# Altium project sonata-board.PrjPcb (part 1 of 2)
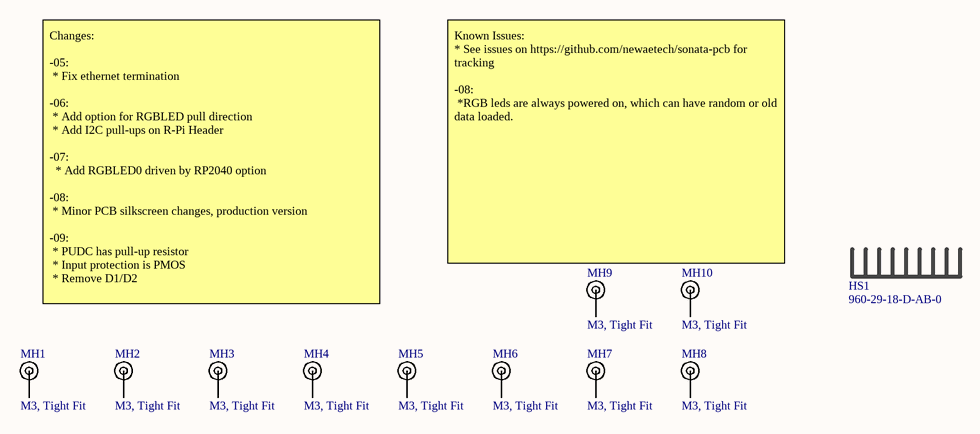
[diagram p0: sb-sonata-mech.SchDoc]
PrjRev: 03; PrjName: Sonata-XL; PrjLicense: CC-SA
7 sheets, 204 parts. Net scope: global (net labels, ports and power ports of the same name join across sheets).
Board files: cheriot-test.PcbDoc, sonata-xl-panel.PcbDoc
Sheets:
  sb-sonata-mech.SchDoc
  sb-sonata-headers1.SchDoc
  sb-sonata-usbrp.SchDoc
  sb-sonata-debug.SchDoc
  sb-sonata-fpgapwr2.SchDoc
  sb-sonata-analoginput.SchDoc
  sb-sonata-psu.SchDoc

## Sheet sb-sonata-mech.SchDoc: Mechanical & Title Page
size Letter; Organization: NewAE Technology Inc.; Address1: 1083 Queen St., Suite 196; Address2: Halifax; Address3: NS; Address4: Canada B3H 0B2; SheetNumber: 1; SheetTotal: 22; SheetApproved: YES

### Parts
HS1  960-29-18-D-AB-0  [960-29-18-D-AB-0]
MH1  M3, Tight Fit  [MOUNT_M3_TIGHT]
MH2  M3, Tight Fit  [MOUNT_M3_TIGHT]
MH3  M3, Tight Fit  [MOUNT_M3_TIGHT]
MH4  M3, Tight Fit  [MOUNT_M3_TIGHT]
MH5  M3, Tight Fit  [MOUNT_M3_TIGHT]
MH6  M3, Tight Fit  [MOUNT_M3_TIGHT]
MH7  M3, Tight Fit  [MOUNT_M3_TIGHT]
MH8  M3, Tight Fit  [MOUNT_M3_TIGHT]
MH9  M3, Tight Fit  [MOUNT_M3_TIGHT]
MH10  M3, Tight Fit  [MOUNT_M3_TIGHT]

### Nets

Not connected (* = marked no-connect by the designer): HS1 MH; MH1 1; MH2 1; MH3 1; MH4 1; MH5 1; MH6 1; MH7 1; MH8 1; MH9 1; MH10 1

### Notes on the sheet
- Changes:
  -05:
  * Fix ethernet termination
  -06:
  * Add option for RGBLED pull direction
  * Add I2C pull-ups on R-Pi Header
  -07:
  * Add RGBLED0 driven by RP2040 option
  -08:
  * Minor PCB silkscreen changes, production version
  -09:
  * PUDC has pull-up resistor
  * Input protection is PMOS
  * Remove D1/D2
- Known Issues:
  * See issues on https://github.com/newaetech/sonata-pcb for tracking
  -08:
  *RGB leds are always powered on, which can have random or old data loaded.
- Title:
- Date:
- Rev:
- Time:
- Project:
- Sheet
- of
- License:
- Copyright © NewAE Technology Inc.
- Approved:
- NewAE.com
- File:

### Library data of the parts
HS1 = 960-29-18-D-AB-0: Heatsink, 29mm square; Manufacture 1: Wakefield-Vette; Component Group: Mechanical; PP Material Stack: 0; Part Number: 960-29-18-D-AB-0; Manufacture Part Number 1: 960-29-18-D-AB-0; Supplier 1: Digi-Key; Supplier Part Number 1: 345-1834-ND; Component Kind: Standard; Component Type: Standard; PP Rotation: 0; PP Rotation1: 0
MH1-MH10 = MOUNT_M3_TIGHT: Machine screw M3 Mounting Hole; Component Group: Mechanical; PP Material Stack: 0; Part Number: MOUNT_M3_TIGHT; Pin Count: 1; Component Kind: Mechanical; Component Type: Mechanical; PP Rotation: 0

## Sheet sb-sonata-headers1.SchDoc: Header Pins
size Letter; Organization: NewAE Technology Inc.; Address1: 1083 Queen St., Suite 196; Address2: Halifax; Address3: NS; Address4: Canada B3H 0B2; SheetNumber: 4; SheetTotal: 20; SheetApproved: YES
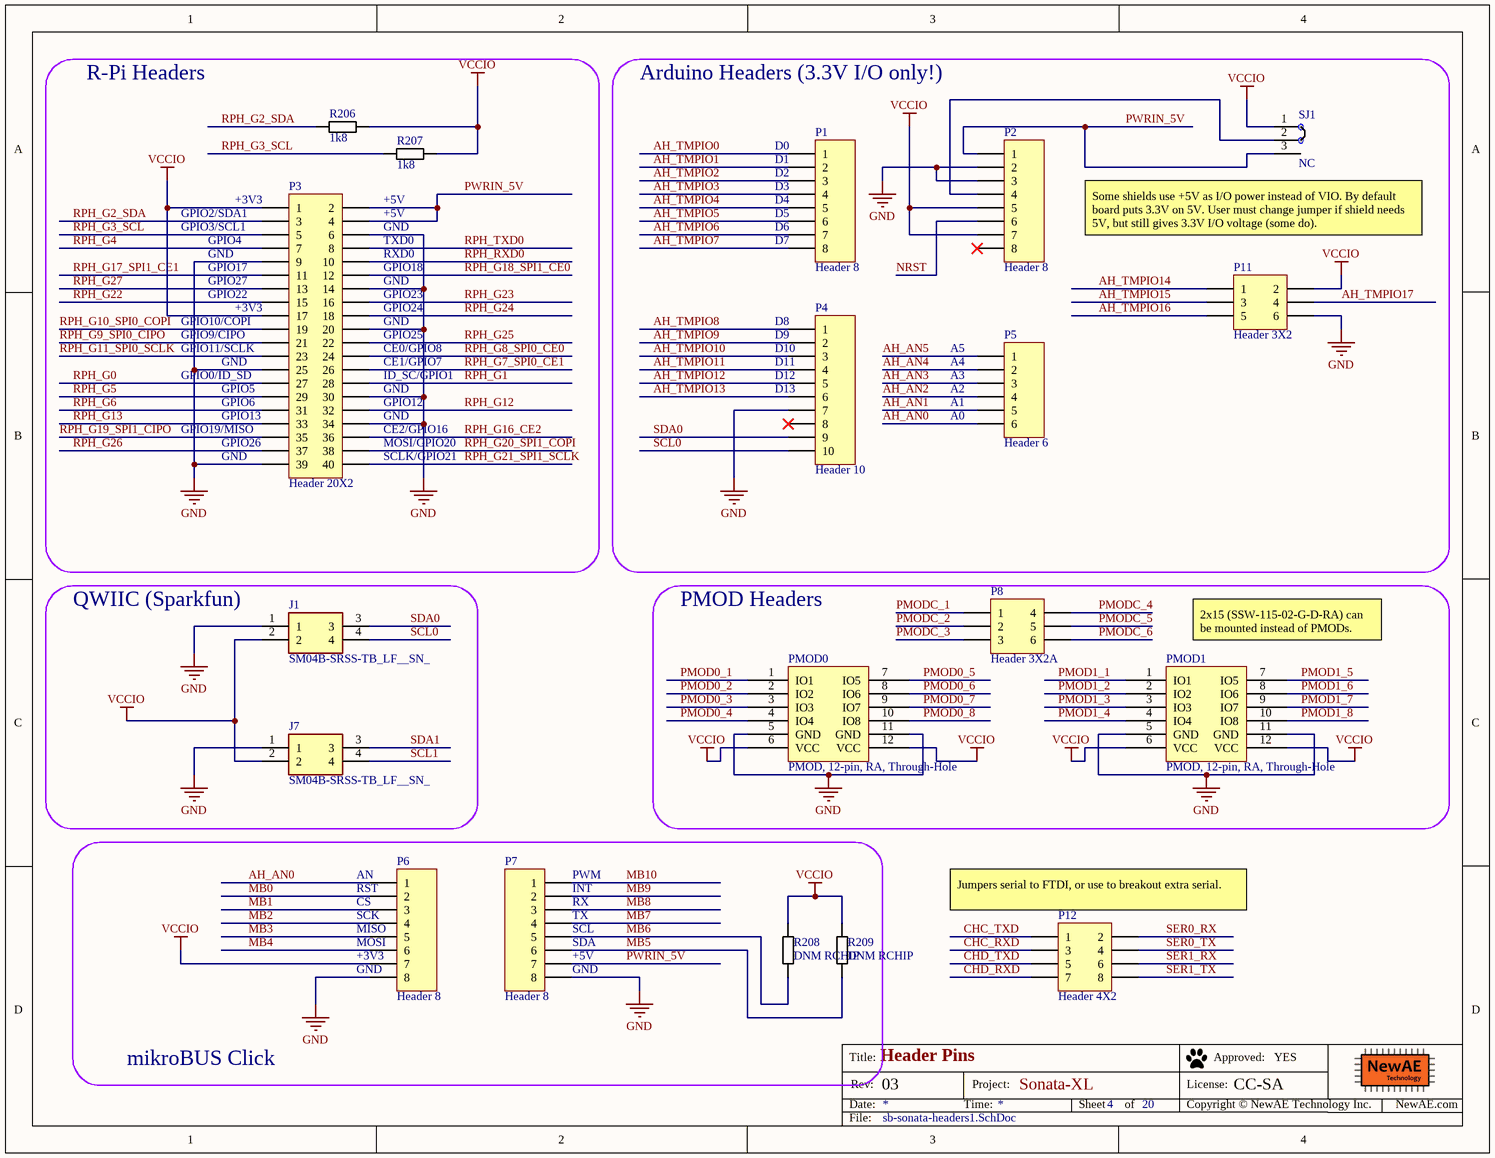
[diagram p1: sb-sonata-headers1.SchDoc]

### Parts
J1  SM04B-SRSS-TB_LF__SN_  [SM04B-SRSS-TB(LFSN)]
J7  SM04B-SRSS-TB_LF__SN_  [SM04B-SRSS-TB(LFSN)]
P1  Header 8  [HDR1X8_SLW-108-01-T-S]
P2  Header 8  [HDR1X8_SLW-108-01-T-S]
P3  Header 20X2  [HDR2X20_861400402YO2LF]
P4  Header 10  [HDR1X10_SLW-110-01-T-S]
P5  Header 6  [HDR1X6_SLW-106-01-T-S]
P6  Header 8  [HDR1X8_SLW-108-01-T-S]
P7  Header 8  [HDR1X8_SLW-108-01-T-S]
P8  Header 3X2A  [HDR2X3_CEN]
P11  Header 3X2  [HDR2X3_XG8T-0641]
P12  Header 4X2  [HDR2X4_XG8T-0841]
PMOD0  PMOD, 12-pin, RA, Through-Hole  [SAMTEC_SSW_106_02_X_D_RA_PMOD]
PMOD1  PMOD, 12-pin, RA, Through-Hole  [SAMTEC_SSW_106_02_X_D_RA_PMOD]
R206  1k8  [RESC1608X55N]
R207  1k8  [RESC1608X55N]
R208  DNM RCHIP  [RESC1608X55N]
R209  DNM RCHIP  [RESC1608X55N]
SJ1  NC  [SJ_3S_NC12]  (no BOM)

### Blocks framed on the sheet
R-Pi Headers: P3 R206 R207
Arduino Headers (3.3V I/O only!): P1 P2 P4 P5 P11 SJ1
QWIIC (Sparkfun): J1 J7
PMOD Headers: P8 PMOD0 PMOD1
mikroBUS Click: P6 P7 R208 R209

### Nets
GND: J1.1 J7.1 P2.2 P2.3 P3.6 P3.9 P3.14 P3.20 P3.25 P3.30 P3.34 P3.39 P4.7 P6.8 P7.8 P11.6 PMOD0.5(GND) PMOD0.11(GND) PMOD1.5(GND) PMOD1.11(GND)
VCCIO: J1.2 J7.2 P2.5 P2.7 P3.1 P3.17 P6.7 P11.2 PMOD0.6(VCC) PMOD0.12(VCC) PMOD1.6(VCC) PMOD1.12(VCC) R206.2 R207.2 R208.1 R209.1 SJ1.1  [project net 3V3_FTDI]
AH_AN0: P5.6 P6.1
AH_AN1: P5.5
AH_AN2: P5.4
AH_AN3: P5.3
AH_AN4: P5.2
AH_AN5: P5.1
AH_TMPIO0: P1.1
AH_TMPIO1: P1.2
AH_TMPIO2: P1.3
AH_TMPIO3: P1.4
AH_TMPIO4: P1.5
AH_TMPIO5: P1.6
AH_TMPIO6: P1.7
AH_TMPIO7: P1.8
AH_TMPIO8: P4.1
AH_TMPIO9: P4.2
AH_TMPIO10: P4.3
AH_TMPIO11: P4.4
AH_TMPIO12: P4.5
AH_TMPIO13: P4.6
AH_TMPIO14: P11.1
AH_TMPIO15: P11.3
AH_TMPIO16: P11.5
AH_TMPIO17: P11.4
CHC_RXD: P12.3
CHC_TXD: P12.1
CHD_RXD: P12.7
CHD_TXD: P12.5
MB0: P6.2
MB1: P6.3
MB2: P6.4
MB3: P6.5
MB4: P6.6
MB5: P7.6 R209.2
MB6: P7.5 R208.2
MB7: P7.4
MB8: P7.3
MB9: P7.2
MB10: P7.1
NRST: P2.6
PMOD0_1: PMOD0.1(IO1)
PMOD0_2: PMOD0.2(IO2)
PMOD0_3: PMOD0.3(IO3)
PMOD0_4: PMOD0.4(IO4)
PMOD0_5: PMOD0.7(IO5)
PMOD0_6: PMOD0.8(IO6)
PMOD0_7: PMOD0.9(IO7)
PMOD0_8: PMOD0.10(IO8)
PMOD1_1: PMOD1.1(IO1)
PMOD1_2: PMOD1.2(IO2)
PMOD1_3: PMOD1.3(IO3)
PMOD1_4: PMOD1.4(IO4)
PMOD1_5: PMOD1.7(IO5)
PMOD1_6: PMOD1.8(IO6)
PMOD1_7: PMOD1.9(IO7)
PMOD1_8: PMOD1.10(IO8)
PMODC_1: P8.1
PMODC_2: P8.2
PMODC_3: P8.3
PMODC_4: P8.4
PMODC_5: P8.5
PMODC_6: P8.6
PWRIN_5V: P2.1 P3.2 P3.4 P7.7 SJ1.3
RPH_G0: P3.27
RPH_G1: P3.28
RPH_G2_SDA: P3.3 R206.1
RPH_G3_SCL: P3.5 R207.1
RPH_G4: P3.7
RPH_G5: P3.29
RPH_G6: P3.31
RPH_G7_SPI0_CE1: P3.26
RPH_G8_SPI0_CE0: P3.24
RPH_G9_SPI0_CIPO: P3.21
RPH_G10_SPI0_COPI: P3.19
RPH_G11_SPI0_SCLK: P3.23
RPH_G12: P3.32
RPH_G13: P3.33
RPH_G16_CE2: P3.36
RPH_G17_SPI1_CE1: P3.11
RPH_G18_SPI1_CE0: P3.12
RPH_G19_SPI1_CIPO: P3.35
RPH_G20_SPI1_COPI: P3.38
RPH_G21_SPI1_SCLK: P3.40
RPH_G22: P3.15
RPH_G23: P3.16
RPH_G24: P3.18
RPH_G25: P3.22
RPH_G26: P3.37
RPH_G27: P3.13
RPH_RXD0: P3.10
RPH_TXD0: P3.8
SCL0: J1.4 P4.10
SCL1: J7.4
SDA0: J1.3 P4.9
SDA1: J7.3
SER0_RX: P12.2
SER0_TX: P12.4
SER1_RX: P12.6
SER1_TX: P12.8
NetP2_4: P2.4 SJ1.2

Not connected (* = marked no-connect by the designer): P2 8*; P4 8*

### Notes on the sheet
- (near P1) D0
- (near P1) D1
- (near P3) GPIO2/SDA1
- (near P3) GPIO3/SCL1
- (near P3) +3V3
- +5V
- (near P3) GND
- (near P1) D2
- (near P1) D3
- (near P1) D4
- (near P1) D5
- (near P1) D6
- (near SJ1) Some shields use +5V as I/O power instead of VIO. By default board puts 3.3V on 5V. User must change jumper if shield needs 5V, but still gives 3.3V I/O voltage (some do).
- (near P3) GPIO4
- GND
- (near P3) GPIO17
- (near P3) GPIO27
- (near P3) GPIO22
- (near P3) TXD0
- (near P3) RXD0
- (near P3) GPIO18
- (near P3) GPIO23
- (near P1) D7
- (near P3) GPIO10/COPI
- (near P3) GPIO9/CIPO
- (near P3) GPIO11/SCLK
- (near P3) GPIO24
- (near P3) GPIO25
- (near P3) CE0/GPIO8
- (near P3) CE1/GPIO7
- (near P4) D8
- (near P4) D9
- (near P4) D10
- (near P4) D11
- (near P5) A4
- (near P5) A5
- (near P3) GPIO0/ID_SD
- (near P3) GPIO19/MISO
- (near P3) GPIO5
- (near P3) GPIO6
- (near P3) GPIO13
- (near P3) ID_SC/GPIO1
- (near P3) GPIO12
- (near P3) CE2/GPIO16
- (near P4) D12
- (near P4) D13
- (near P5) A0
- (near P5) A1
- (near P5) A2
- (near P5) A3
- (near P3) GPIO26
- (near P3) MOSI/GPIO20
- (near P3) SCLK/GPIO21
- (near PMOD1) 2x15 (SSW-115-02-G-D-RA) can be mounted instead of PMODs.
- (near P6) AN
- (near P6) RST
- (near P6) CS
- (near P7) RX
- (near P7) INT
- (near P7) PWM
- (near P12) Jumpers serial to FTDI, or use to breakout extra serial.
- (near P6) SCK
- (near P6) MISO
- (near P6) MOSI
- (near P6) +3V3
- (near P6) GND
- (near P7) GND
- (near P7) +5V
- (near P7) SDA
- (near P7) SCL
- (near P7) TX
- Title:
- Date:
- Rev:
- Time:
- Project:
- Sheet
- of
- License:
- Copyright © NewAE Technology Inc.
- Approved:
- NewAE.com
- File:

### Library data of the parts
J1 J7 = SM04B-SRSS-TB_LF__SN_: Connector; Manufacturer_Name: JST (JAPAN SOLDERLESS TERMINALS); Manufacturer_Part_Number: SM04B-SRSS-TB(LF)(SN); Datasheet Link: http://www.jst-mfg.com/product/pdf/eng/eSH.pdf; Arrow Part Number: SM04B-SRSS-TB(LF)(SN); Arrow Price/Stock: https://www.arrow.com/en/products/sm04b-srss-tb-lf-sn/jst-manufacturing?region=europe
P1 P2 P6 P7 = Header 8: Header, 8-Pin; LatestRevisionDate: 17-Jul-2002; LatestRevisionNote: Re-released for DXP Platform.; Publisher: Altium Limited
P3 = Header 20X2: Header, 20-Pin, Dual row; LatestRevisionDate: 17-Jul-2002; LatestRevisionNote: Re-released for DXP Platform.; Publisher: Altium Limited
P4 = Header 10: Header, 10-Pin; LatestRevisionDate: 17-Jul-2002; LatestRevisionNote: Re-released for DXP Platform.; Publisher: Altium Limited
P5 = Header 6: Header, 6-Pin; LatestRevisionDate: 17-Jul-2002; LatestRevisionNote: Re-released for DXP Platform.; Publisher: Altium Limited
P8 = Header 3X2A: Header, 3-Pin, Dual row; LatestRevisionDate: 17-Jul-2002; LatestRevisionNote: Re-released for DXP Platform.; Publisher: Altium Limited
P11 = Header 3X2: Header, 3-Pin, Dual row; LatestRevisionDate: 17-Jul-2002; LatestRevisionNote: Re-released for DXP Platform.; Publisher: Altium Limited
P12 = Header 4X2: Header, 4-Pin, Dual row; LatestRevisionDate: 17-Jul-2002; LatestRevisionNote: Re-released for DXP Platform.; Publisher: Altium Limited
PMOD0 PMOD1 = PMOD_2ROW_FEMALERATH: Component Group: Connector; PP Material Stack: 0; Part Number: PMOD_2ROW_FEMALERATH; Pin Count: 12; Supplier 1: Digi-Key; Supplier Part Number 1: SAM1215-06-ND; Component Kind: Standard; Component Type: Standard; PP Rotation: 0; PP Rotation1: 0
R206 R207 = RCHIP-1K8-0603: 1k8 res, 0603, 1%, 1/10W; Manufacture 1: Yageo; Manufacture Part Number 1: RC0603FR-071K8L; Component Group: Resistor; Case-EIA: 0603; Case-Metric: 1608; Rated Power: 0.1W; Rated Voltage: 75VDC; Part Number: RCHIP-1K8-0603; Footprint: 0603; Pin Count: 2; Supplier 1: Digi-Key; Supplier Part Number 1: 311-1.80KHRCT-ND; Value: 1k8; Tolerance: 1%; Mounting Technology: SMT; Temperature Range: -55C to 155C; Component Kind: Standard; Component Type: Standard
R208 R209 = RCHIP-DNM-0603: Do Not Mount Resistor; Case-EIA: 0603; Case-Metric: 1608; Part Number: RCHIP-DNM-0603; Component Group: Resistor; Footprint: 0603; Pin Count: 2; Mounting Technology: SMT; Component Kind: Standard; Component Type: Standard
SJ1 = SJ_3S_12JMP: Solder Jumper, NC; Component Group: PCB Feature; Part Number: SJ_3S_12JMP; Pin Count: 3; Mounting Technology: COPPER; Component Type: Standard (No BOM)

## Sheet sb-sonata-usbrp.SchDoc: RP2040 Controller
size Letter; Organization: NewAE Technology Inc.; Address1: 1083 Queen St., Suite 196; Address2: Halifax; Address3: NS; Address4: Canada B3H 0B2; SheetNumber: 5; SheetTotal: 22; SheetApproved: YES
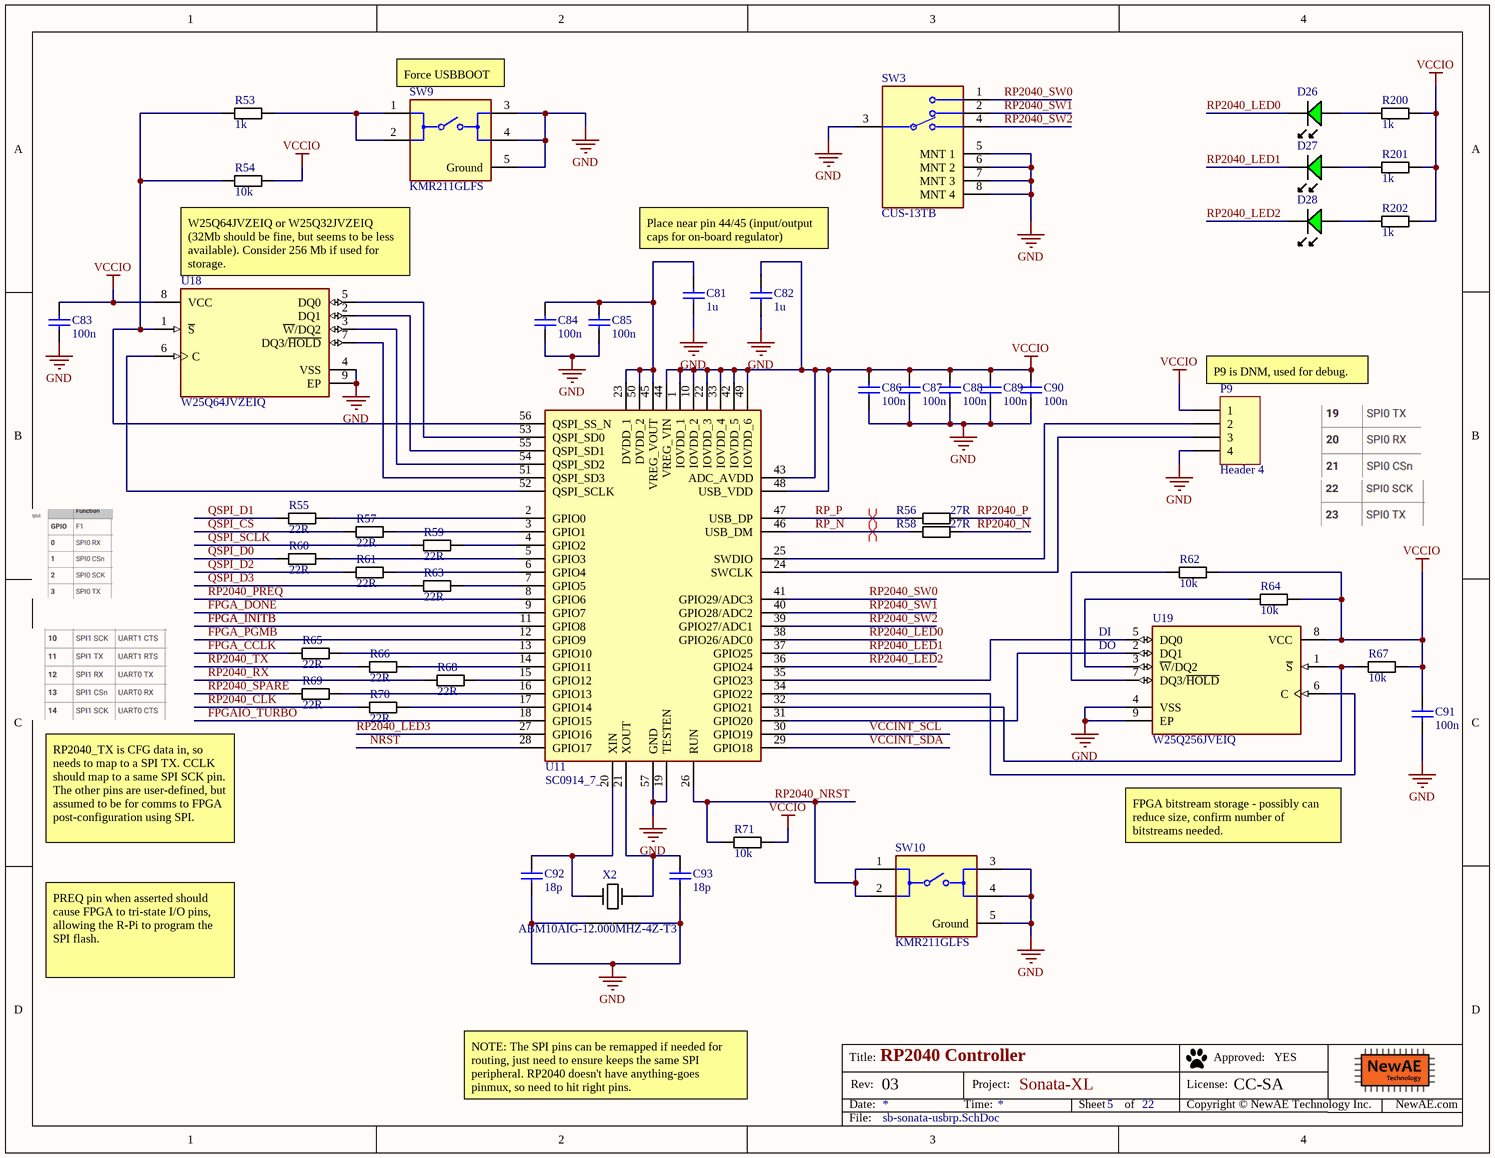
[diagram p2: sb-sonata-usbrp.SchDoc]

### Parts
C81  1u  [CAPC0603_M]
C82  1u  [CAPC0603_M]
C83  100n  [CAPC0402_M]
C84  100n  [CAPC0402_M]
C85  100n  [CAPC0402_M]
C86  100n  [CAPC0402_M]
C87  100n  [CAPC0402_M]
C88  100n  [CAPC0402_M]
C89  100n  [CAPC0402_M]
C90  100n  [CAPC0402_M]
C91  100n  [CAPC0402_M]
C92  18p  [CAPC0402_M]
C93  18p  [CAPC0402_M]
D26  LED, 0603, Green  [LED-0603-GREEN]  (value not drawn)
D27  LED, 0603, Green  [LED-0603-GREEN]  (value not drawn)
D28  LED, 0603, Green  [LED-0603-GREEN]  (value not drawn)
P9  Header 4  [HDR1X4]
R53  1k  [RESC1005X40N]
R54  10k  [RESC1005X40N]
R55  22R  [RESC1005X40N]
R56  27R  [RESC1005X40N]
R57  22R  [RESC1005X40N]
R58  27R  [RESC1005X40N]
R59  22R  [RESC1005X40N]
R60  22R  [RESC1005X40N]
R61  22R  [RESC1005X40N]
R62  10k  [RESC1005X40N]
R63  22R  [RESC1005X40N]
R64  10k  [RESC1005X40N]
R65  22R  [RESC1005X40N]
R66  22R  [RESC1005X40N]
R67  10k  [RESC1005X40N]
R68  22R  [RESC1005X40N]
R69  22R  [RESC1005X40N]
R70  22R  [RESC1005X40N]
R71  10k  [RESC1005X40N]
R200  1k  [RESC1005X40N]
R201  1k  [RESC1005X40N]
R202  1k  [RESC1005X40N]
SW3  CUS-13TB  [FP-CUS-13TB-MFG]
SW9  KMR211GLFS  [FP-KMR211GLFS-MFG]
SW10  KMR211GLFS  [FP-KMR211GLFS-MFG]
U11  SC0914_7_  [QFN40P700X700X90-57N-D]
U18  W25Q64JVZEIQ  [WSON68_Micron]
U19  W25Q256JVEIQ  [WSON68_Micron]
X2  ABM10AIG-12.000MHZ-4Z-T3  [2.5x2mm XTAL]

### Nets
GND: C81.2 C82.2 C83.2 C84.2 C85.2 C86.2 C87.2 C88.2 C89.2 C90.2 C91.2 C92.2 C93.2 P9.4 SW3.3(C) SW3.5(MNT_1) SW3.6(MNT_2) SW3.7(MNT_3) SW3.8(MNT_4) SW9.3 SW9.4 SW9.5(Ground) SW10.3 SW10.4 SW10.5(Ground) U11.19(TESTEN) U11.57(GND) U18.4(VSS) U18.9(EP) U19.4(VSS) U19.9(EP) X2.2(GND) X2.4(GND)
VCCIO: C82.1 C83.1 C86.1 C87.1 C88.1 C89.1 C90.1 C91.1 P9.1 R54.1 R62.1 R64.1 R67.2 R71.2 R200.2 R201.2 R202.2 U11.1(IOVDD_1) U11.10(IOVDD_2) U11.22(IOVDD_3) U11.33(IOVDD_4) U11.42(IOVDD_5) U11.43(ADC_AVDD) U11.44(VREG_VIN) U11.48(USB_VDD) U11.49(IOVDD_6) U18.8(VCC) U19.8(VCC)  [project net 3V3_FTDI]
FPGA_CCLK: R65.1
FPGA_DONE: U11.9(GPIO7)
FPGA_INITB: U11.11(GPIO8)
FPGA_PGMB: U11.12(GPIO9)
FPGAIO_TURBO: U11.18(GPIO15)
NRST: U11.28(GPIO17)
QSPI_CS: R57.1
QSPI_D0: R60.1
QSPI_D1: R55.1
QSPI_D2: R61.1
QSPI_D3: R63.1
QSPI_SCLK: R59.1
RP2040_CLK: R70.1
RP2040_LED0: D26.K U11.38(GPIO26/ADC0)
RP2040_LED1: D27.K U11.37(GPIO25)
RP2040_LED2: D28.K U11.36(GPIO24)
RP2040_LED3: U11.27(GPIO16)
RP2040_N: R58.1
RP2040_NRST: R71.1 SW10.1 SW10.2 U11.26(RUN)
RP2040_P: R56.1
RP2040_PREQ: U11.8(GPIO6)
RP2040_RX: R68.1
RP2040_SPARE: R69.1
RP2040_SW0: SW3.1 U11.41(GPIO29/ADC3)
RP2040_SW1: SW3.2 U11.40(GPIO28/ADC2)
RP2040_SW2: SW3.4 U11.39(GPIO27/ADC1)
RP2040_TX: R66.1
RP_N: R58.2 U11.46(USB_DM)
RP_P: R56.2 U11.47(USB_DP)
VCCINT_SCL: U11.30(GPIO19)
VCCINT_SDA: U11.29(GPIO18)
NetC81_1: C81.1 C84.1 C85.1 U11.23(DVDD_1) U11.45(VREG_VOUT) U11.50(DVDD_2)
NetC92_1: C92.1 U11.20(XIN) X2.1(IN)
NetC93_1: C93.1 U11.21(XOUT) X2.3(OUT)
NetD26_A: D26.A R200.1
NetD27_A: D27.A R201.1
NetD28_A: D28.A R202.1
NetP9_2: P9.2 U11.25(SWDIO)
NetP9_3: P9.3 U11.24(SWCLK)
NetR53_1: R53.1 R54.2 U11.56(QSPI_SS_N) U18.1(~{S})
NetR53_2: R53.2 SW9.1 SW9.2
NetR55_2: R55.2 U11.2(GPIO0)
NetR57_2: R57.2 U11.3(GPIO1)
NetR59_2: R59.2 U11.4(GPIO2)
NetR60_2: R60.2 U11.5(GPIO3)
NetR61_2: R61.2 U11.6(GPIO4)
NetR62_2: R62.2 U19.7(DQ3/~{HOLD})
NetR63_2: R63.2 U11.7(GPIO5)
NetR64_2: R64.2 U19.3(~{W}/DQ2)
NetR65_2: R65.2 U11.13(GPIO10)
NetR66_2: R66.2 U11.14(GPIO11)
NetR67_1: R67.1 U11.32(GPIO21) U19.1(~{S})
NetR68_2: R68.2 U11.15(GPIO12)
NetR69_2: R69.2 U11.16(GPIO13)
NetR70_2: R70.2 U11.17(GPIO14)
NetU11_31: U11.31(GPIO20) U19.2(DQ1)
NetU11_34: U11.34(GPIO22) U19.6(C)
NetU11_35: U11.35(GPIO23) U19.5(DQ0)
NetU11_51: U11.51(QSPI_SD3) U18.7(DQ3/~{HOLD})
NetU11_52: U11.52(QSPI_SCLK) U18.6(C)
NetU11_53: U11.53(QSPI_SD0) U18.5(DQ0)
NetU11_54: U11.54(QSPI_SD2) U18.3(~{W}/DQ2)
NetU11_55: U11.55(QSPI_SD1) U18.2(DQ1)

### Layout directives
differential pair; differential pair class USB_DIFF_PAIR: RP_N, RP_P

### Notes on the sheet
- (near SW9) Force USBBOOT
- W25Q64JVZEIQ or W25Q32JVZEIQ (32Mb should be fine, but seems to be less available). Consider 256 Mb if used for storage.
- Place near pin 44/45 (input/output caps for on-board regulator)
- (near P9) P9 is DNM, used for debug.
- (near U19) DI
- (near U19) DO
- RP2040_TX is CFG data in, so needs to map to a SPI TX. CCLK should map to a same SPI SCK pin. The other pins are user-defined, but assumed to be for comms to FPGA post-configuration using SPI.
- FPGA bitstream storage - possibly can reduce size, confirm number of bitstreams needed.
- PREQ pin when asserted should cause FPGA to tri-state I/O pins, allowing the R-Pi to program the SPI flash.
- NOTE: The SPI pins can be remapped if needed for routing, just need to ensure keeps the same SPI peripheral. RP2040 doesn't have anything-goes pinmux, so need to hit right pins.
- Title:
- Date:
- Rev:
- Time:
- Project:
- Sheet
- of
- License:
- Copyright © NewAE Technology Inc.
- Approved:
- NewAE.com
- File:

### Library data of the parts
C81 C82 = CCHIP-1u-0603: 1u, 0603, 50V; Manufacture Part Number 1: CL10A105KB8NNNC; Component Group: Capacitor; Case-EIA: 0603; Case-Metric: 1608; Rated Voltage: 50VDC; Part Number: CCHIP-1u-0603; Footprint: 0603; Pin Count: 2; Supplier 1: Digi-Key; Supplier Part Number 1: 1276-1860-1-ND; Value: 1u; Mounting Technology: SMT; Component Kind: Standard; Component Type: Standard
C83-C91 = CCHIP-100n-0402: 100n, 0402; Manufacture Part Number 1: CGA2B3X7R1V104K050BB; Component Group: Capacitor; Case-EIA: 0402; Part Number: CCHIP-100n-0402; Footprint: 0402; Pin Count: 2; Supplier 1: Digi-Key; Supplier Part Number 1: 445-6901-1-ND; Value: 100n; Mounting Technology: SMT; Component Kind: Standard; Component Type: Standard
C92 C93 = CCHIP-18p-0402: 18p, 0402; Manufacture Part Number 1: GRM1555C1H180JA01D; Component Group: Capacitor; Case-EIA: 0402; Part Number: CCHIP-18p-0402; Footprint: 0402; Pin Count: 2; Supplier 1: Digi-Key; Supplier Part Number 1: 490-5858-1-ND; Value: 18p; Mounting Technology: SMT; Component Kind: Standard; Component Type: Standard
D26-D28 = LEDCHIP_0603_GREEN: Chip LED, Green; Manufacture 1: Kingbright; Manufacture Part Number 1: APT1608CGCK; Component Group: Optical; PP Material Stack: 16; PP Rotation: -90; Part Number: LEDCHIP_0603_GREEN; Pin Count: 2; Supplier 1: Digi-Key; Supplier Part Number 1: 754-1116-1-ND; Mounting Technology: SMT; Component Kind: Standard; Component Type: Standard
P9 = Header 4: Header, 4-Pin; LatestRevisionDate: 17-Jul-2002; LatestRevisionNote: Re-released for DXP Platform.; Publisher: Altium Limited
R53 R200-R202 = RCHIP-1K-0402: 1k res, 0402, 1%, 1/16W; Manufacture 1: Yageo; Manufacture Part Number 1: RC0402FR-071KL; Component Group: Resistor; Case-EIA: 0402; Case-Metric: 1005; Rated Power: 0.063W; Rated Voltage: 75VDC; Part Number: RCHIP-1K-0402; Footprint: 0402; Pin Count: 2; Supplier 1: Digi-Key; Supplier Part Number 1: 311-1.00KLRCT-ND; Value: 1k; Tolerance: 1%; Mounting Technology: SMT; Temperature Range: -55C to 155C; Component Kind: Standard; Component Type: Standard
R54 R62 R64 R67 R71 = RCHIP-10K-0402: 10k res, 0402, 1%, 1/16W; Manufacture 1: Yageo; Manufacture Part Number 1: RC0402FR-0710KL; Component Group: Resistor; Case-EIA: 0402; Case-Metric: 1005; Rated Power: 0.063W; Rated Voltage: 75VDC; Part Number: RCHIP-10K-0402; Footprint: 0402; Pin Count: 2; Supplier 1: Digi-Key; Supplier Part Number 1: 311-10.0KLRCT-ND; Value: 10k; Tolerance: 1%; Mounting Technology: SMT; Temperature Range: -55C to 155C; Component Kind: Standard; Component Type: Standard
R55 R57 R59-R61 R63 R65 R66 R68-R70 = RCHIP-22R-0402: 22R res, 0402, 1%, 1/16W; Manufacture 1: Yageo; Manufacture Part Number 1: RC0402FR-0722RL; Component Group: Resistor; Case-EIA: 0402; Case-Metric: 1005; Rated Power: 0.063W; Rated Voltage: 75VDC; Part Number: RCHIP-22R-0402; Footprint: 0402; Pin Count: 2; Supplier 1: Digi-Key; Supplier Part Number 1: 311-22.0LRCT-ND; Value: 22R; Tolerance: 1%; Mounting Technology: SMT; Temperature Range: -55C to 155C; Component Kind: Standard; Component Type: Standard
R56 R58 = RCHIP-27R-0402: 27R res, 0402, 1%, 1/16W; Manufacture 1: Yageo; Manufacture Part Number 1: RC0402FR-0727RL; Component Group: Resistor; Case-EIA: 0402; Case-Metric: 1005; Rated Power: 0.063W; Rated Voltage: 75VDC; Part Number: RCHIP-27R-0402; Footprint: 0402; Pin Count: 2; Supplier 1: Digi-Key; Supplier Part Number 1: YAG3086CT-ND; Value: 27R; Tolerance: 1%; Mounting Technology: SMT; Temperature Range: -55C to 155C; Component Kind: Standard; Component Type: Standard
SW3 = CMP-71745-000014-1: SWITCH SLIDE SP3T 300MA 4V; Actuator Length: 1.5mm; Electrical Life: 10000Cycles; Max Voltage Rating (DC): 20V; Switch Function: On-On-On; Actuator Material: Nylon; Actuator Type: Standard; Contact Style: Non-Shorting; Contact Plating: Gold; Termination: Gull Wing; Radiation Hardening: No; Series: CUS; Max Operating Temperature: 70°C; Mount: Surface Mount; Switch Travel: 1.5mm; Packaging: Tape and Reel; Min Operating Temperature: -20°C; Contact Material: Copper Alloy; Orientation: Right Angle; Voltage Rating (DC): 4V; RoHS Compliant: Yes; Current Rating: 300mA; Throw Configuration: SP3T
SW9 SW10 = CMP-10040-000023-1: SWITCH TACTILE SPST-NO 0.05A 32V; Switch Function: Off-Mom; Throw Configuration: SPST; Switch Travel: 0.2mm; Current Rating: 50mA; Illumination Type: Non-Illuminated; Actuator Length: 0.5mm; Power Rating: 1W; Operating Force: 1.2N; Actuator Type: Standard; Mechanical Life: 200000Cycles; REACH SVHC: No SVHC; Voltage Rating (DC): 32V; Length: 2.8mm; Min Operating Temperature: -40°C; Mount: Surface Mount; Max Voltage Rating (DC): 32V; Width: 2.8mm; Depth: 4.6mm; Packaging: Tape and Reel; Lead Free: Lead Free; Contact Material: Silver; Termination: Gull Wing; Package Quantity: 1; Contact Current Rating: 50mA; Orientation: Straight; Max Operating Temperature: 85°C; Radiation Hardening: No; Max Current Rating: 50mA; Contact Plating: Silver
U11 = SC0914_7_: Connector; Manufacturer_Name: RASPBERRY-PI; Manufacturer_Part_Number: SC0914(7); Datasheet Link: https://www.mouser.com/datasheet/2/635/rp2040_datasheet-3048960.pdf; Height: 0.9mm; Mouser Part Number: 358-SC09147; Mouser Price/Stock: https://www.mouser.co.uk/ProductDetail/Raspberry-Pi/SC09147?qs=T%252BzbugeAwjhSpdbCB4ve%252Bg%3D%3D
U18 = MT25QL256ABA1EW9-0SIT: IC FLASH 64M SPI 133MHZ 8WPDFN; Manufacture 1: Winbond; Component Group: Digital IC; PP Material Stack: 0; Part Number: W25Q64JVZEIQ; Footprint: WSON-8x6; Manufacture Part Number 1: W25Q64JVZEIQ; Pin Count: 9; Supplier 1: Digi-Key; Mounting Technology: SMT; RoHS: Yes; Component Kind: Standard; Component Type: Standard; PP Rotation: 0; PP Rotation1: 0
U19 = MT25QL256ABA1EW9-0SIT: IC FLASH 256M SPI 133MHZ 8WPDFN; Manufacture 1: Winbond; Component Group: Digital IC; PP Material Stack: 0; Part Number: W25Q256JVEIQ; Footprint: WSON-8x6; Manufacture Part Number 1: W25Q256JVEIQ; Pin Count: 9; Supplier 1: Digi-Key; Mounting Technology: SMT; RoHS: Yes; Component Kind: Standard; Component Type: Standard; PP Rotation: 0; PP Rotation1: 0
X2 = ABM10AIG-12.000MHZ-4Z-T3: 12MHz, SMD; Manufacture 1: Abracon LLC; Component Group: Crystal; PP Material Stack: 0; Part Number: ABM10AIG-12.000MHZ-4Z-T3; Manufacture Part Number 1: ABM10AIG-12.000MHZ-4Z-T3; Pin Count: 4; Supplier 1: Digi-Key; Supplier Part Number 1: 535-13360-1-ND; Value: 12.000MHz; Mounting Technology: SMT; Component Kind: Standard; Component Type: Standard; PP Rotation: 0

## Sheet sb-sonata-debug.SchDoc: FTDI Interface (Debug Programming)
size Letter; Organization: NewAE Technology Inc.; Address1: 1083 Queen St., Suite 196; Address2: Halifax; Address3: NS; Address4: Canada B3H 0B2; SheetNumber: 7; SheetTotal: 22; SheetApproved: YES
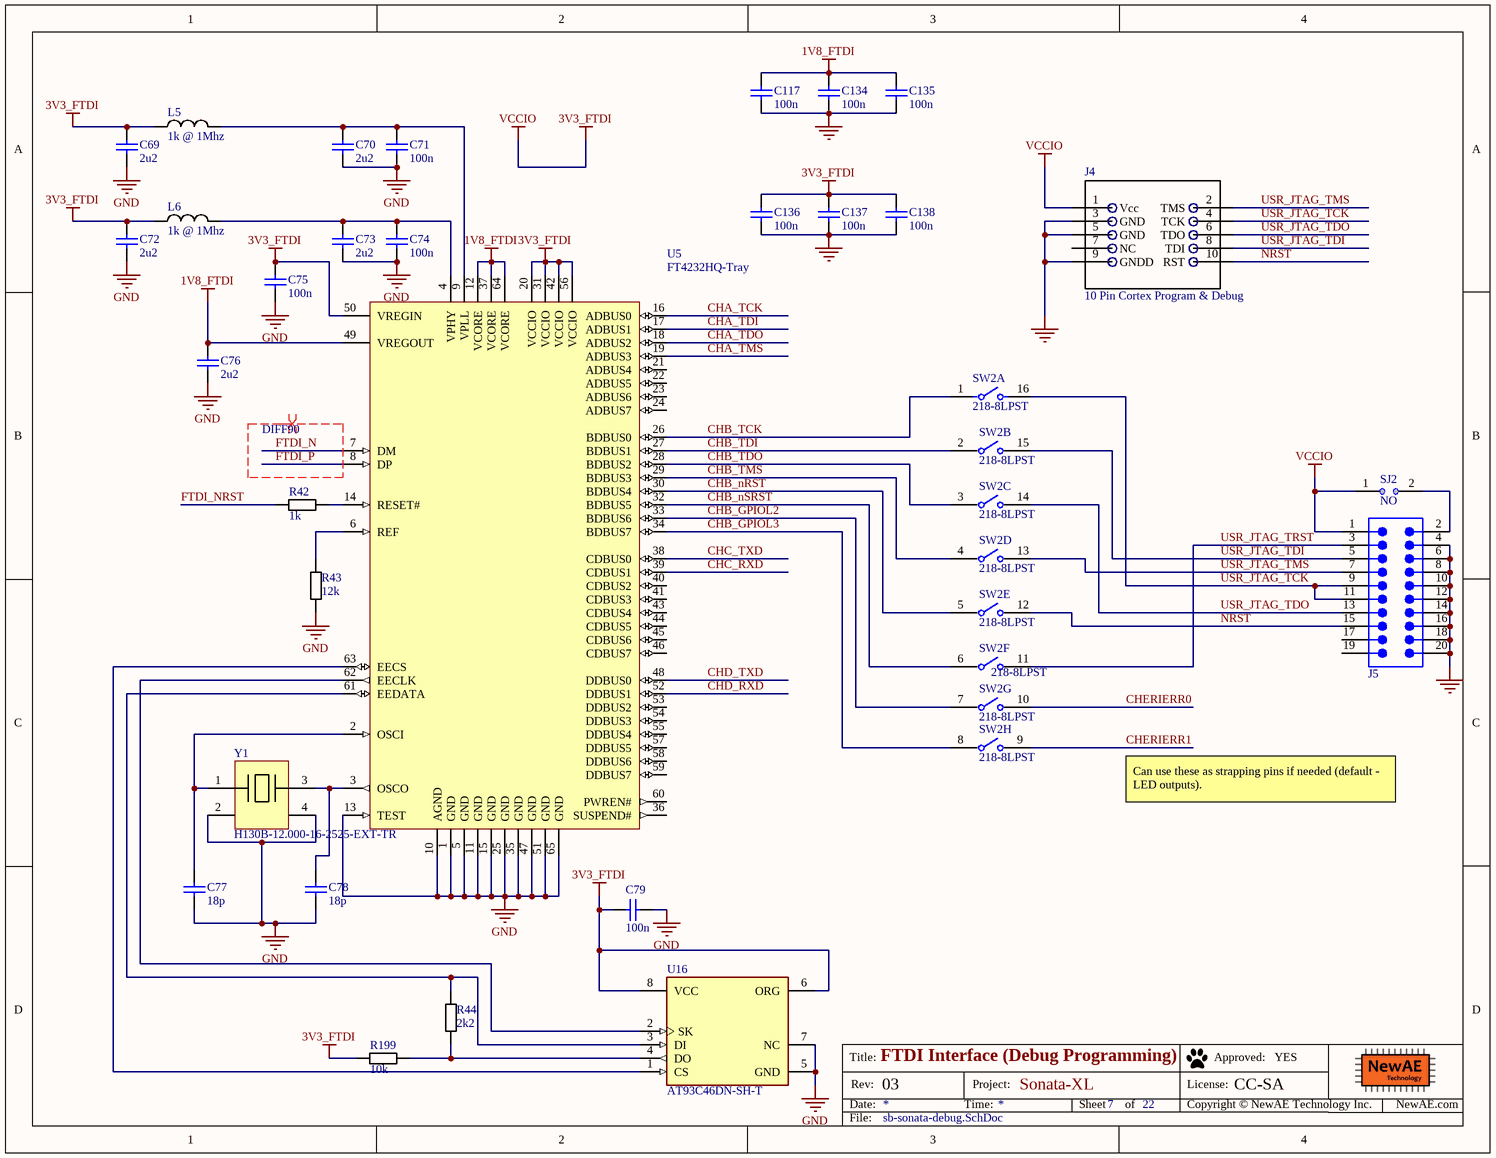
[diagram p3: sb-sonata-debug.SchDoc]

### Parts
C69  2u2  [CAPC0603_M]
C70  2u2  [CAPC0603_M]
C71  100n  [CAPC0402_M]
C72  2u2  [CAPC0603_M]
C73  2u2  [CAPC0603_M]
C74  100n  [CAPC0402_M]
C75  100n  [CAPC0402_M]
C76  2u2  [CAPC0603_M]
C77  18p  [CAPC0402_M]
C78  18p  [CAPC0402_M]
C79  100n  [CAPC0402_M]
C117  100n  [CAPC0402_M]
C134  100n  [CAPC0402_M]
C135  100n  [CAPC0402_M]
C136  100n  [CAPC0402_M]
C137  100n  [CAPC0402_M]
C138  100n  [CAPC0402_M]
J4  10 Pin Cortex Program & Debug  [0.5mm_SMD_Header_5x2]
J5  61232020621  [61232020621]  (value not drawn)
L5  1k @ 1Mhz  [IND_0603]
L6  1k @ 1Mhz  [IND_0603]
R42  1k  [RESC1005X40N]
R43  12k  [RESC1608X55N]
R44  2k2  [RESC1005X40N]
R199  10k  [RESC1005X40N]
SJ2  NO  [SJ_2S_NO]  (no BOM)
SW2  218-8LPST  [FP-218-8LPST-MFG]  (parts A,B,C,D,E,F,G,H of 8)
U5  FT4232HQ-Tray  [QFN64_2_N]
U16  AT93C46DN-SH-T  [FP-C04-057-SN-MFG]
Y1  H130B-12.000-16-2525-EXT-TR  [5x3.2MM XTAL]

### Nets
1V8_FTDI: C76.1 C117.1 C134.1 C135.1 U5.12(VCORE) U5.37(VCORE) U5.49(VREGOUT) U5.64(VCORE)
3V3_FTDI: C69.1 C72.1 C75.1 C79.1 C136.1 C137.1 C138.1 J4.1(Vcc) J5.1 L5.1 L6.1 R199.1 SJ2.1 U5.20(VCCIO) U5.31(VCCIO) U5.42(VCCIO) U5.50(VREGIN) U5.56(VCCIO) U16.6(ORG) U16.8(VCC)  [also labelled VCCIO]
GND: C69.2 C70.2 C71.2 C72.2 C73.2 C74.2 C75.2 C76.2 C77.2 C78.2 C79.2 C117.2 C134.2 C135.2 C136.2 C137.2 C138.2 J4.3(GND) J4.5(GND) J4.9(GNDD) J5.4 J5.6 J5.8 J5.10 J5.12 J5.14 J5.16 J5.18 J5.20 R43.2 U5.1(GND) U5.5(GND) U5.10(AGND) U5.11(GND) U5.13(TEST) U5.15(GND) U5.25(GND) U5.35(GND) U5.47(GND) U5.51(GND) U5.65(GND) U16.5(GND) U16.7(NC) Y1.2 Y1.4
CHA_TCK: U5.16(ADBUS0)
CHA_TDI: U5.17(ADBUS1)
CHA_TDO: U5.18(ADBUS2)
CHA_TMS: U5.19(ADBUS3)
CHB_GPIOL2: SW2.7 U5.33(BDBUS6)
CHB_GPIOL3: SW2.8 U5.34(BDBUS7)
CHB_nRST: SW2.5 U5.30(BDBUS4)
CHB_nSRST: SW2.6 U5.32(BDBUS5)
CHB_TCK: SW2.1 U5.26(BDBUS0)
CHB_TDI: SW2.2 U5.27(BDBUS1)
CHB_TDO: SW2.3 U5.28(BDBUS2)
CHB_TMS: SW2.4 U5.29(BDBUS3)
CHC_RXD: U5.39(CDBUS1)
CHC_TXD: U5.38(CDBUS0)
CHD_RXD: U5.52(DDBUS1)
CHD_TXD: U5.48(DDBUS0)
CHERIERR0: SW2.10
CHERIERR1: SW2.9
FTDI_N: U5.7(DM)
FTDI_NRST: R42.2
FTDI_P: U5.8(DP)
NRST: J4.10(RST) J5.15 SW2.12
USR_JTAG_TCK: J4.4(TCK) J5.9 J5.11 SW2.16
USR_JTAG_TDI: J4.8(TDI) J5.5 SW2.15
USR_JTAG_TDO: J4.6(TDO) J5.13 SW2.14
USR_JTAG_TMS: J4.2(TMS) J5.7 SW2.13
USR_JTAG_TRST: J5.3 SW2.11
NetC70_1: C70.1 C71.1 L5.2 U5.9(VPLL)
NetC73_1: C73.1 C74.1 L6.2 U5.4(VPHY)
NetC77_1: C77.1 U5.2(OSCI) Y1.1
NetC78_1: C78.1 U5.3(OSCO) Y1.3
NetJ5_2: J5.2 SJ2.2
NetR42_1: R42.1 U5.14(RESET#)
NetR43_1: R43.1 U5.6(REF)
NetR44_1: R44.1 U5.61(EEDATA) U16.3(DI)
NetR44_2: R44.2 R199.2 U16.4(DO)
NetU5_62: U5.62(EECLK) U16.2(SK)
NetU5_63: U5.63(EECS) U16.1(CS)

Not connected (* = marked no-connect by the designer): J4 7(NC); J5 17 19; U5 21(ADBUS4) 22(ADBUS5) 23(ADBUS6) 24(ADBUS7) 36(SUSPEND#) 40(CDBUS2) 41(CDBUS3) 43(CDBUS4) 44(CDBUS5) 45(CDBUS6) 46(CDBUS7) 53(DDBUS2) 54(DDBUS3) 55(DDBUS4) 57(DDBUS5) 58(DDBUS6) 59(DDBUS7) 60(PWREN#)

### Layout directives
differential pair; differential pair class DIFF90: FTDI_N, FTDI_P

### Notes on the sheet
- Can use these as strapping pins if needed (default - LED outputs).
- Title:
- Date:
- Rev:
- Time:
- Project:
- Sheet
- of
- License:
- Copyright © NewAE Technology Inc.
- Approved:
- NewAE.com
- File:

### Library data of the parts
C69 C70 C72 C73 C76 = CCHIP-2u2-0603: 2u2, 0603; Manufacture 1: Samsung; Manufacture Part Number 1: CL10B225KP8NNNC; Component Group: Capacitor; Case-EIA: 0603; Case-Metric: 1608; Rated Voltage: 10VDC; Part Number: CCHIP-2u2-0603; Footprint: 0603; Pin Count: 2; Supplier 1: Digi-Key; Supplier Part Number 1: 1276-1134-1-ND; Value: 2u2; Mounting Technology: SMT; Component Kind: Standard; Component Type: Standard
C71 C74 C75 C79 C117 C134-C138 = CCHIP-100n-0402: as C83 on sheet sb-sonata-usbrp; Part Number: CCHIP-100n-0402; Footprint: 0402; Pin Count: 2; Supplier 1: Digi-Key; Supplier Part Number 1: 445-6901-1-ND; Value: 100n; Mounting Technology: SMT; Component Kind: Standard; Component Type: Standard
C77 C78 = CCHIP-18p-0402: as C92 on sheet sb-sonata-usbrp; Part Number: CCHIP-18p-0402; Footprint: 0402; Pin Count: 2; Supplier 1: Digi-Key; Supplier Part Number 1: 490-5858-1-ND; Value: 18p; Mounting Technology: SMT; Component Kind: Standard; Component Type: Standard
J4 = Cortex_Debug_Header_10Pin: 10 Pin Cortex Program & Debug 0.5mm pitch; Manufacture Part Number 1: 20021121-00010C4LF; Component Group: Connector; PP Material Stack: 0; Part Number: Cortex_Debug_Header_10Pin; Pin Count: 10; Supplier 1: Digi-Key; Supplier Part Number 1: 609-3695-1-ND; Mounting Technology: SMT; RoHS: Yes; Component Kind: Standard; Component Type: Standard; PP Rotation: 0
J5 = 61232020621: WR-BHD Male Box Header, SMT Straight, pitch 2.54mm, 2 row, 20 pin; Manufacturer: Wurth Elektronik; Contact Resistance: 20mOhm; Insulation Resistance: 1000MOhm; Rated Current: 3A; Working Voltage: 250V; Withstanding Voltage: 500V; Manufacturer Part Number: 61232020621; Category: Wire-to-Board Connectors; Match Code: WR-BHD; ComponentLink1Description: Website Link; ComponentLink1URL: https://www.we-online.com/redexpert/article/61232020621?ad; ComponentLink2Description: Datasheet Link; ComponentLink2URL: https://www.we-online.com/redexpert/spec/61232020621?ad; Mount: Surface Mount; Operating Temperature Max: 125°C; Operating Temperature Min: -40°C; Packaging: Tape and Reel with Cap; Length: 33.2mm; Width: 9.1mm; Height: 9.1mm; Gender: Male; Number of Pins: 20; Number of Rows: 2; Orientation: Straight; Pitch: 2.54mm
L5 L6 = FBCHIP-1k-0603: Ferrite Beads HI CUR CHIP BD 0603 1000OHMS 25%; Manufacture 1: Taiyo Yuden; Manufacture Part Number 1: FBMH1608HM102-T / FBMH1608HM102-T / FBMH1608HM102-T / FBMH1608HM102-T; Component Group: Inductor; PP Material Stack: 0; Part Number: FBCHIP-1k-0603; Footprint: 0603; Pin Count: 2; Supplier 1: Mouser; Supplier Part Number 1: 963-FBMH1608HM102-T; Mounting Technology: SMT; RoHS: Yes; Component Kind: Standard; Component Type: Standard; PP Rotation: 0
R42 = RCHIP-1K-0402: as R53 on sheet sb-sonata-usbrp; Part Number: RCHIP-1K-0402; Footprint: 0402; Pin Count: 2; Supplier 1: Digi-Key; Supplier Part Number 1: 311-1.00KLRCT-ND; Value: 1k; Tolerance: 1%; Mounting Technology: SMT; Temperature Range: -55C to 155C; Component Kind: Standard; Component Type: Standard
R43 = RCHIP-12K-0603: 12k res, 0603, 1%, 1/10W; Manufacture 1: Yageo; Manufacture Part Number 1: RC0603FR-0712KL; Component Group: Resistor; Case-EIA: 0603; Case-Metric: 1608; Rated Power: 0.1W; Rated Voltage: 75VDC; Part Number: RCHIP-12K-0603; Footprint: 0603; Pin Count: 2; Supplier 1: Digi-Key; Supplier Part Number 1: 311-12.0KHRCT-ND; Value: 12k; Tolerance: 1%; Mounting Technology: SMT; Temperature Range: -55C to 155C; Component Kind: Standard; Component Type: Standard
R44 = RCHIP-2K2-0402: 2k2 res, 0402, 1%, 1/16W; Manufacture 1: Yageo; Manufacture Part Number 1: RC0402FR-072K2L; Component Group: Resistor; Case-EIA: 0402; Case-Metric: 1005; Rated Power: 0.063W; Rated Voltage: 75VDC; Part Number: RCHIP-2K2-0402; Footprint: 0402; Pin Count: 2; Supplier 1: Digi-Key; Supplier Part Number 1: 311-2.20KLRCT-ND; Value: 2k2; Tolerance: 1%; Mounting Technology: SMT; Temperature Range: -55C to 155C; Component Kind: Standard; Component Type: Standard
R199 = RCHIP-10K-0402: as R54 on sheet sb-sonata-usbrp; Part Number: RCHIP-10K-0402; Footprint: 0402; Pin Count: 2; Supplier 1: Digi-Key; Supplier Part Number 1: 311-10.0KLRCT-ND; Value: 10k; Tolerance: 1%; Mounting Technology: SMT; Temperature Range: -55C to 155C; Component Kind: Standard; Component Type: Standard
SJ2 = SJ_2S_NO: Solder Jumper, NO; Component Group: PCB Feature; Part Number: SJ_2S_NO; Pin Count: 2; Mounting Technology: COPPER; Component Type: Standard (No BOM)
SW2 = CMP-07018-000007-1: SWITCH SLIDE DIP SPST 25MA 24V; Number of Positions: 8; Pitch: 0.05inch; Actuator Type: Slide (Standard); Electrical Life: 1000Cycles; Washable: Yes; Contact Resistance: 100mR; Radiation Hardening: No; Packaging: Rail/Tube; Length: 0.446inch; Depth: 8.44mm; Max Voltage Rating (DC): 24V; Lead Free: Lead Free; Mount: Surface Mount; RoHS Compliant: Yes; Series: 218; Max Operating Temperature: 85°C; Termination: Gull Wing; Voltage Rating (DC): 24V; Current Rating: 25mA; Contact Plating: Gold; Min Operating Temperature: -55°C; Terminal Pitch: 1.27mm; Contact Material: Copper; Throw Configuration: SPST; Orientation: Straight; Max Current Rating: 25mA; Height: 2.65mm; Package Quantity: 40
U5 = CMP-0078-00002-3: Quad High Speed USB To Multipurpose UART/MPSSE IC, 64-pin QFN, Tray; Manufacturer: FTDI; PackageDescription: 64-Pin Quad Flat No-Lead, 9 x 9 mm Body, 0.5 mm Pitch, 4.35 x 4.35 mm Exposed Pad; PackageVersion: Jan-12; ComponentLink2URL: http://www.ftdichip.com/Support/Documents/DataSheets/ICs/DS_FT4232H.pdf; RevisionNote: DatasheetVersion updated to 2.2 Jan-2012; ComponentLink1Description: Manufacturer URL; DatasheetVersion: ver 2.2, Jan-2012; PackageReference: QFN64_2; ComponentLink2Description: Datasheet; ComponentLink1URL: http://www.ftdichip.com/; PartNumber: FT4232HQ-Tray
U16 = CMP-06313-000016-1: IC EEPROM 1K SPI 2MHZ 8SOIC; Manufacturer: Microchip; Nominal Supply Current: 0.5mA; Memory Size: 1Kbits; Access Time: 1000ns; Max Supply Voltage: 5.5V; Interface: Other; Standoff Height: 0.1mm; Min Supply Voltage: 1.8V; Category: IC; Temperature Range High: +85°C; Mouser Description: EEPROM Serial-3Wire 1K-Bit 128 x 8/64 x 16 2.5V/3.3V/5V 8-Pin SOIC T/R; Ipc Land Pattern Name: SOIC127P600X175-8; Temperature Range Low: -40°C; Temperature: -40°C to +85°C; Digikey Description: IC EEPROM 1K SPI 2MHZ 8SOIC; Lead Free: Yes; Device Class L2: Memory; ComponentLink2URL: http://ww1.microchip.com/downloads/en/DeviceDoc/20006224B.pdf; Automotive: No; Device Class L3: EEPROM; Package: C04-057-SN; Octopart: https://octopart.com/at93c46dn-sh-t-microchip-77759177; RoHS: TRUE; Memory Type: EEPROM; Height: 1.75mm; Manufacturer Part Number: AT93C46DN-SH-T; ComponentLink2Description: Datasheet; Frequency: 2MHz; Device Class L1: Integrated Circuits (ICs)
Y1 = H130B-12.000-16-2525-EXT-TR: 12MHz ±25ppm Crystal 16pF 35 Ohms 4-SMD, No Lead; Manufacture 1: Raltron Electronics; Value: 12.000MHz; PP Material Stack: 0; Supplier 1: Digi-Key; Stock 1: 4955; Pricing 1: 1=0.590000, 10=0.488000, 50=0.439400, 100=0.390600, 500=0.371100 (USD); Supplier Part Number 1: 2151-H130B-12.000-16-2525-EXT-TR-ND; .Checked SCH: *; .Checked PCB: *; Manufacturer Part Number: H130B-12.000-16-2525-EXT-TR; Part Number: H130B-12.000-16-2525-EXT-TR; Component Group: Crystal; Footprint: 5x3.2mm; Manufacture Part Number 1: H130B-12.000-16-2525-EXT-TR; Pin Count: 4; Mounting Technology: SMT; Component Kind: Standard; Component Type: Standard; PP Rotation: 0

## Sheet sb-sonata-fpgapwr2.SchDoc: <Enter Sheet Title>
size Letter; Organization: NewAE Technology Inc.; Address1: 1083 Queen St., Suite 196; Address2: Halifax; Address3: NS; Address4: Canada B3H 0B2; SheetNumber: 15; SheetTotal: 22; SheetApproved: NO
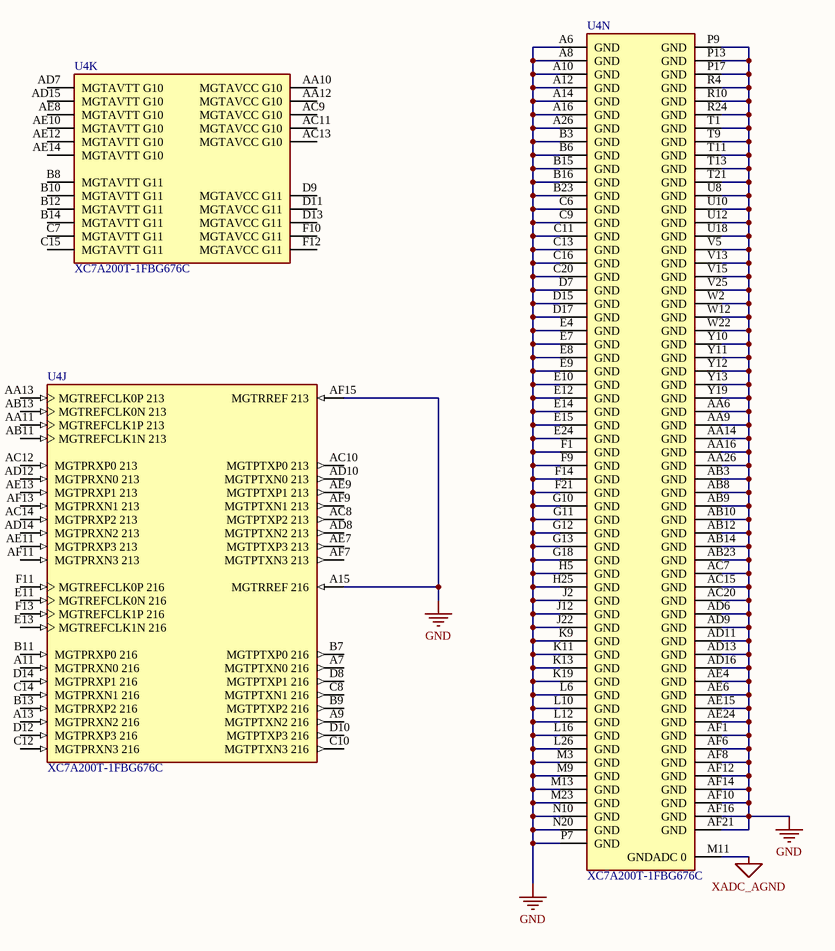
[diagram p4: sb-sonata-fpgapwr2.SchDoc]

### Parts
U4  XC7A200T-1FBG676C  [FP-XC7A200T-1FBG676C-MFG]  (parts J,K,N of 14)

### Nets
GND: U4.A6(GND) U4.A8(GND) U4.A10(GND) U4.A12(GND) U4.A14(GND) U4.A15(MGTRREF_216) U4.A16(GND) U4.A26(GND) U4.AA6(GND) U4.AA9(GND) U4.AA14(GND) U4.AA16(GND) U4.AA26(GND) U4.AB3(GND) U4.AB8(GND) U4.AB9(GND) U4.AB10(GND) U4.AB12(GND) U4.AB14(GND) U4.AB23(GND) U4.AC7(GND) U4.AC15(GND) U4.AC20(GND) U4.AD6(GND) U4.AD9(GND) U4.AD11(GND) U4.AD13(GND) U4.AD16(GND) U4.AE4(GND) U4.AE6(GND) U4.AE15(GND) U4.AE24(GND) U4.AF1(GND) U4.AF6(GND) U4.AF8(GND) U4.AF10(GND) U4.AF12(GND) U4.AF14(GND) U4.AF15(MGTRREF_213) U4.AF16(GND) U4.AF21(GND) U4.B3(GND) U4.B6(GND) U4.B15(GND) U4.B16(GND) U4.B23(GND) U4.C6(GND) U4.C9(GND) U4.C11(GND) U4.C13(GND) U4.C16(GND) U4.C20(GND) U4.D7(GND) U4.D15(GND) U4.D17(GND) U4.E4(GND) U4.E7(GND) U4.E8(GND) U4.E9(GND) U4.E10(GND) U4.E12(GND) U4.E14(GND) U4.E15(GND) U4.E24(GND) U4.F1(GND) U4.F9(GND) U4.F14(GND) U4.F21(GND) U4.G10(GND) U4.G11(GND) U4.G12(GND) U4.G13(GND) U4.G18(GND) U4.H5(GND) U4.H25(GND) U4.J2(GND) U4.J12(GND) U4.J22(GND) U4.K9(GND) U4.K11(GND) U4.K13(GND) U4.K19(GND) U4.L6(GND) U4.L10(GND) U4.L12(GND) U4.L16(GND) U4.L26(GND) U4.M3(GND) U4.M9(GND) U4.M13(GND) U4.M23(GND) U4.N10(GND) U4.N20(GND) U4.P7(GND) U4.P9(GND) U4.P13(GND) U4.P17(GND) U4.R4(GND) U4.R10(GND) U4.R24(GND) U4.T1(GND) U4.T9(GND) U4.T11(GND) U4.T13(GND) U4.T21(GND) U4.U8(GND) U4.U10(GND) U4.U12(GND) U4.U18(GND) U4.V5(GND) U4.V13(GND) U4.V15(GND) U4.V25(GND) U4.W2(GND) U4.W12(GND) U4.W22(GND) U4.Y10(GND) U4.Y11(GND) U4.Y12(GND) U4.Y13(GND) U4.Y19(GND)
XADC_AGND: U4.M11(GNDADC_0)

Not connected (* = marked no-connect by the designer): U4 A7(MGTPTXN0_216) A9(MGTPTXN2_216) A11(MGTPRXN0_216) A13(MGTPRXN2_216) AA10(MGTAVCC_G10) AA11(MGTREFCLK1P_213) AA12(MGTAVCC_G10) AA13(MGTREFCLK0P_213) AB11(MGTREFCLK1N_213) AB13(MGTREFCLK0N_213) AC8(MGTPTXP2_213) AC9(MGTAVCC_G10) AC10(MGTPTXP0_213) AC11(MGTAVCC_G10) AC12(MGTPRXP0_213) AC13(MGTAVCC_G10) AC14(MGTPRXP2_213) AD7(MGTAVTT_G10) AD8(MGTPTXN2_213) AD10(MGTPTXN0_213) AD12(MGTPRXN0_213) AD14(MGTPRXN2_213) AD15(MGTAVTT_G10) AE7(MGTPTXP3_213) AE8(MGTAVTT_G10) AE9(MGTPTXP1_213) AE10(MGTAVTT_G10) AE11(MGTPRXP3_213) AE12(MGTAVTT_G10) AE13(MGTPRXP1_213) AE14(MGTAVTT_G10) AF7(MGTPTXN3_213) AF9(MGTPTXN1_213) AF11(MGTPRXN3_213) AF13(MGTPRXN1_213) B7(MGTPTXP0_216) B8(MGTAVTT_G11) B9(MGTPTXP2_216) B10(MGTAVTT_G11) B11(MGTPRXP0_216) B12(MGTAVTT_G11) B13(MGTPRXP2_216) B14(MGTAVTT_G11) C7(MGTAVTT_G11) C8(MGTPTXN1_216) C10(MGTPTXN3_216) C12(MGTPRXN3_216) C14(MGTPRXN1_216) C15(MGTAVTT_G11) D8(MGTPTXP1_216) D9(MGTAVCC_G11) D10(MGTPTXP3_216) D11(MGTAVCC_G11) D12(MGTPRXP3_216) D13(MGTAVCC_G11) D14(MGTPRXP1_216) E11(MGTREFCLK0N_216) E13(MGTREFCLK1N_216) F10(MGTAVCC_G11) F11(MGTREFCLK0P_216) F12(MGTAVCC_G11) F13(MGTREFCLK1P_216)

### Notes on the sheet
- Title:
- Date:
- Rev:
- Time:
- Project:
- Sheet
- of
- License:
- Copyright © NewAE Technology Inc.
- Approved:
- NewAE.com
- File:

### Library data of the parts
U4 = CMP-0364-00015-4: IC FPGA 400 I/O 676FCBGA; Manufacturer: Xilinx; Min Supply Voltage: 0.95V; Number Of Logic Elements Cells: 215360; Ciiva Ids: 8919048; Memory Type: DDR3; Max Supply Voltage: 1.05V; Number Of Registers: 269200; Number Of I/Os: 500; Max Junction Temp: +85°C; Ram Size: 13455360bits; Number Of Logic Blocks: 16825; Standoff Height: 0.4mm; Speed Grade: 1; Import Ts: 1521861070; Memory Size: 1GBytes; Lead Free: Yes; Height: 2.54mm; Octopart: https://octopart.com/xc7a200t-1fbg676c-xilinx-27810760; Ipc Land Pattern Name: BGA676C100P26X26_2700X2700X234; Manufacturer Part Number: XC7A200T-1FBG676C; Package: 0; Device Class L1: Integrated Circuits (ICs); Device Class L3: FPGAs - Field Programmable Gate Arrays; Temperature: 0°C to +85°C; Release Date: 1402465632; Temperature Range High: +85°C; Device Class L2: Embedded Processors and Controllers; RoHS: TRUE; ComponentLink2URL: https://www.xilinx.com/support/documentation/data_sheets/ds181_Artix_7_Data_Sheet.pdf; Temperature Range Low: 0°C; Digikey Description: IC FPGA 400 I/O 676FCBGA; Footprint Url: https://www.xilinx.com/support/documentation/user_guides/ug475_7Series_Pkg_Pinout.pdf; Automotive: No; Category: IC; ComponentLink2Description: Datasheet

## Sheet sb-sonata-analoginput.SchDoc: Analog Conversion
size Letter; Organization: NewAE Technology Inc.; Address1: 1083 Queen St., Suite 196; Address2: Halifax; Address3: NS; Address4: Canada B3H 0B2; SheetNumber: 16; SheetTotal: 20; SheetApproved: YES
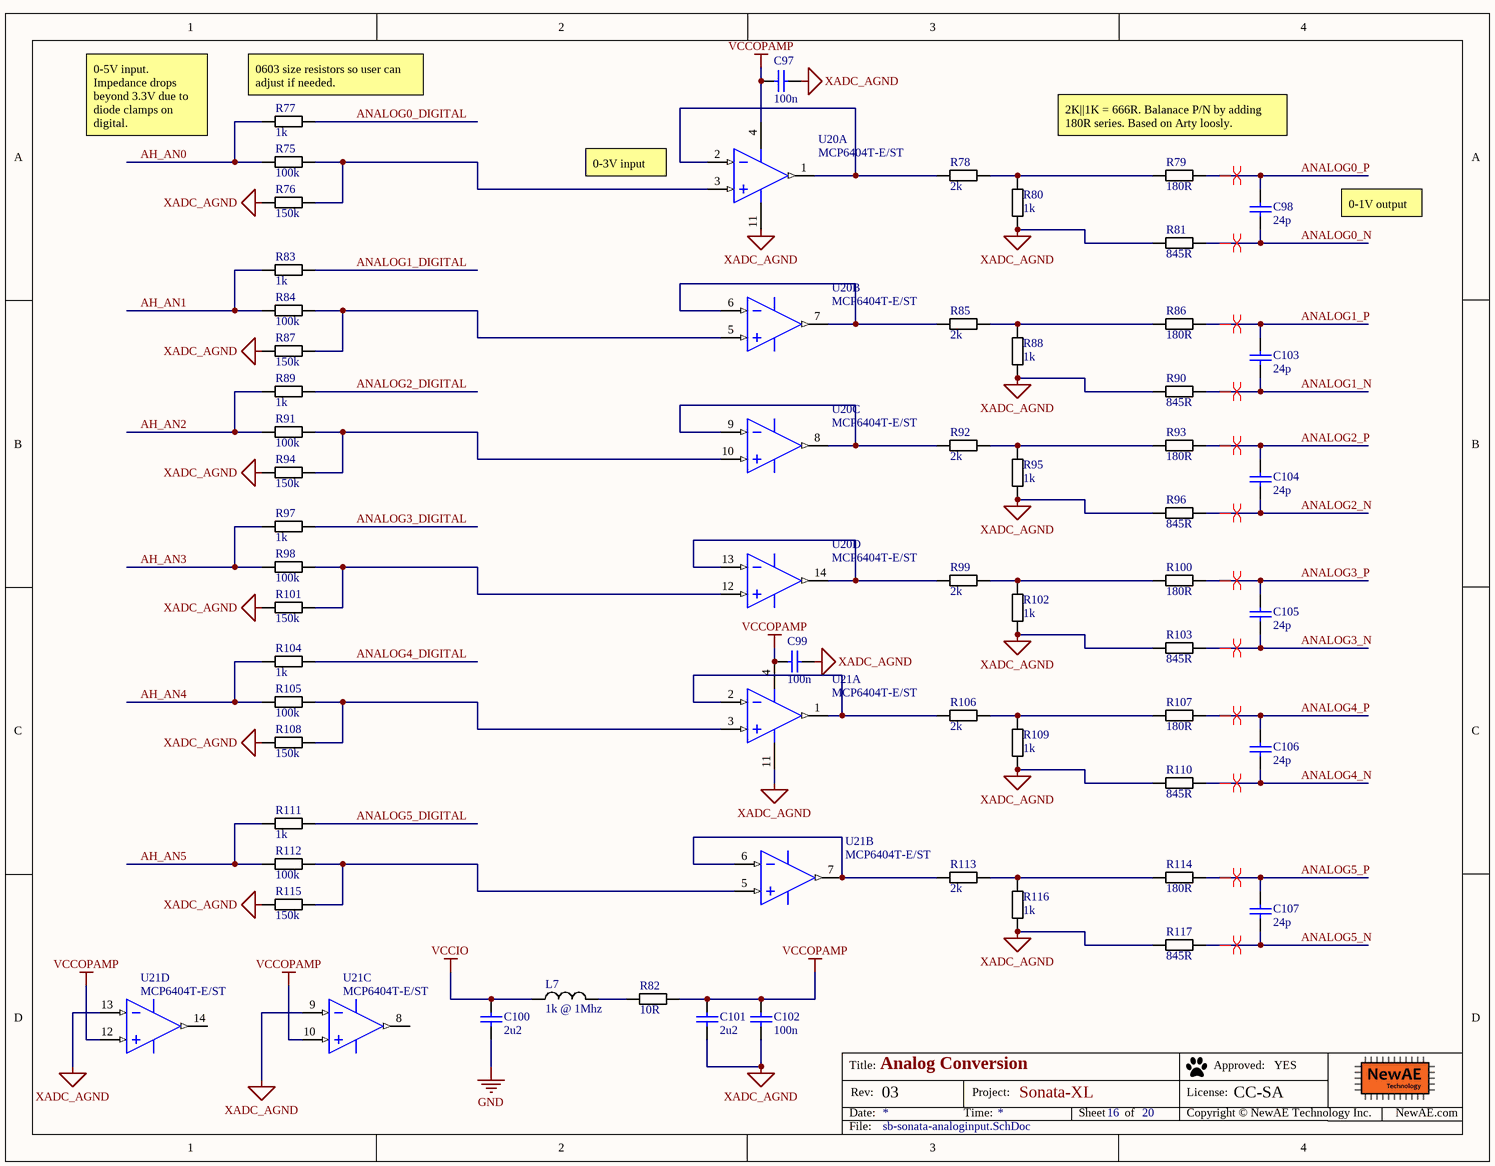
[diagram p5: sb-sonata-analoginput.SchDoc]

### Parts
C97  100n  [CAPC0402_M]
C98  24p  [CAPC0402_M]
C99  100n  [CAPC0402_M]
C100  2u2  [CAPC0603_M]
C101  2u2  [CAPC0603_M]
C102  100n  [CAPC0402_M]
C103  24p  [CAPC0402_M]
C104  24p  [CAPC0402_M]
C105  24p  [CAPC0402_M]
C106  24p  [CAPC0402_M]
C107  24p  [CAPC0402_M]
L7  1k @ 1Mhz  [IND_0603]
R75  100k  [RESC1608X55N]
R76  150k  [RESC1608X55N]
R77  1k  [RESC1608X55N]
R78  2k  [RESC1005X40N]
R79  180R  [RESC1005X40N]
R80  1k  [RESC1005X40N]
R81  845R  [RESC1005X40N]
R82  10R  [RESC1608X55N]
R83  1k  [RESC1608X55N]
R84  100k  [RESC1608X55N]
R85  2k  [RESC1005X40N]
R86  180R  [RESC1005X40N]
R87  150k  [RESC1608X55N]
R88  1k  [RESC1005X40N]
R89  1k  [RESC1608X55N]
R90  845R  [RESC1005X40N]
R91  100k  [RESC1608X55N]
R92  2k  [RESC1005X40N]
R93  180R  [RESC1005X40N]
R94  150k  [RESC1608X55N]
R95  1k  [RESC1005X40N]
R96  845R  [RESC1005X40N]
R97  1k  [RESC1608X55N]
R98  100k  [RESC1608X55N]
R99  2k  [RESC1005X40N]
R100  180R  [RESC1005X40N]
R101  150k  [RESC1608X55N]
R102  1k  [RESC1005X40N]
R103  845R  [RESC1005X40N]
R104  1k  [RESC1608X55N]
R105  100k  [RESC1608X55N]
R106  2k  [RESC1005X40N]
R107  180R  [RESC1005X40N]
R108  150k  [RESC1608X55N]
R109  1k  [RESC1005X40N]
R110  845R  [RESC1005X40N]
R111  1k  [RESC1608X55N]
R112  100k  [RESC1608X55N]
R113  2k  [RESC1005X40N]
R114  180R  [RESC1005X40N]
R115  150k  [RESC1608X55N]
R116  1k  [RESC1005X40N]
R117  845R  [RESC1005X40N]
U20  MCP6404T-E/ST  [TSSOP-ST14_M]  (parts A,B,C,D of 4)
U21  MCP6404T-E/ST  [TSSOP-ST14_M]  (parts A,B,C,D of 4)

### Nets
GND: C100.2
VCCIO: C100.1 L7.1  [project net 3V3_FTDI]
VCCOPAMP: C97.1 C99.1 C101.1 C102.1 R82.2 U20.4(VDD) U21.4(VDD) U21.10(VINC+) U21.12(VIND+)
XADC_AGND: C97.2 C99.2 C101.2 C102.2 R76.1 R80.2 R81.1 R87.1 R88.2 R90.1 R94.1 R95.2 R96.1 R101.1 R102.2 R103.1 R108.1 R109.2 R110.1 R115.1 R116.2 R117.1 U20.11(VSS) U21.9(VINC-) U21.11(VSS) U21.13(VIND-)
AH_AN0: R75.1 R77.1
AH_AN1: R83.1 R84.1
AH_AN2: R89.1 R91.1
AH_AN3: R97.1 R98.1
AH_AN4: R104.1 R105.1
AH_AN5: R111.1 R112.1
ANALOG0_DIGITAL: R77.2
ANALOG0_N: C98.2 R81.2
ANALOG0_P: C98.1 R79.2
ANALOG1_DIGITAL: R83.2
ANALOG1_N: C103.2 R90.2
ANALOG1_P: C103.1 R86.2
ANALOG2_DIGITAL: R89.2
ANALOG2_N: C104.2 R96.2
ANALOG2_P: C104.1 R93.2
ANALOG3_DIGITAL: R97.2
ANALOG3_N: C105.2 R103.2
ANALOG3_P: C105.1 R100.2
ANALOG4_DIGITAL: R104.2
ANALOG4_N: C106.2 R110.2
ANALOG4_P: C106.1 R107.2
ANALOG5_DIGITAL: R111.2
ANALOG5_N: C107.2 R117.2
ANALOG5_P: C107.1 R114.2
NetL7_2: L7.2 R82.1
NetR75_2: R75.2 R76.2 U20.3(VINA+)
NetR78_1: R78.1 U20.1(VOUTA) U20.2(VINA-)
NetR78_2: R78.2 R79.1 R80.1
NetR84_2: R84.2 R87.2 U20.5(VINB+)
NetR85_1: R85.1 U20.6(VINB-) U20.7(VOUTB)
NetR85_2: R85.2 R86.1 R88.1
NetR91_2: R91.2 R94.2 U20.10(VINC+)
NetR92_1: R92.1 U20.8(VOUTC) U20.9(VINC-)
NetR92_2: R92.2 R93.1 R95.1
NetR98_2: R98.2 R101.2 U20.12(VIND+)
NetR99_1: R99.1 U20.13(VIND-) U20.14(VOUTD)
NetR99_2: R99.2 R100.1 R102.1
NetR105_2: R105.2 R108.2 U21.3(VINA+)
NetR106_1: R106.1 U21.1(VOUTA) U21.2(VINA-)
NetR106_2: R106.2 R107.1 R109.1
NetR112_2: R112.2 R115.2 U21.5(VINB+)
NetR113_1: R113.1 U21.6(VINB-) U21.7(VOUTB)
NetR113_2: R113.2 R114.1 R116.1

Not connected (* = marked no-connect by the designer): U21 8(VOUTC) 14(VOUTD)

### Layout directives
differential pair; Parameter 1: ANALOG_DIFF_PAIR: ANALOG0_N, ANALOG0_P, ANALOG1_N, ANALOG1_P, ANALOG2_N, ANALOG2_P, ANALOG3_N, ANALOG3_P, ANALOG4_N, ANALOG4_P, ANALOG5_N, ANALOG5_P

### Notes on the sheet
- (near R77) 0603 size resistors so user can adjust if needed.
- 0-5V input. Impedance drops beyond 3.3V due to diode clamps on digital.
- 0-3V input
- (near R79) 2K||1K = 666R. Balanace P/N by adding 180R series. Based on Arty loosly.
- 0-1V output
- Title:
- Date:
- Rev:
- Time:
- Project:
- Sheet
- of
- License:
- Copyright © NewAE Technology Inc.
- Approved:
- NewAE.com
- File:

### Library data of the parts
C97 C99 C102 = CCHIP-100n-0402: as C83 on sheet sb-sonata-usbrp; Part Number: CCHIP-100n-0402; Footprint: 0402; Pin Count: 2; Supplier 1: Digi-Key; Supplier Part Number 1: 445-6901-1-ND; Value: 100n; Mounting Technology: SMT; Component Kind: Standard; Component Type: Standard
C98 C103-C107 = CCHIP-24p-0402: 24p, 0402; Manufacture 1: Murata Electronics; Manufacture Part Number 1: GCM1555C1H240FA16D; Component Group: Capacitor; Case-EIA: 0402; Case-Metric: 1005; Rated Voltage: 50V; Part Number: CCHIP-24p-0402; Footprint: 0402; Pin Count: 2; Supplier 1: Digi-Key; Supplier Part Number 1: 490-GCM1555C1H240FA16DTR-ND; Value: 24p; Mounting Technology: SMT; RoHS: Yes; Component Kind: Standard; Component Type: Standard
C100 C101 = CCHIP-2u2-0603: as C69 on sheet sb-sonata-debug; Part Number: CCHIP-2u2-0603; Footprint: 0603; Pin Count: 2; Supplier 1: Digi-Key; Supplier Part Number 1: 1276-1134-1-ND; Value: 2u2; Mounting Technology: SMT; Component Kind: Standard; Component Type: Standard
L7 = FBCHIP-1k-0603: as L5 on sheet sb-sonata-debug; Part Number: FBCHIP-1k-0603; Footprint: 0603; Pin Count: 2; Supplier 1: Mouser; Supplier Part Number 1: 963-FBMH1608HM102-T; Mounting Technology: SMT; RoHS: Yes; Component Kind: Standard; Component Type: Standard; PP Rotation: 0
R75 R84 R91 R98 R105 R112 = RCHIP-100K-0603: 100k res, 0603, 1%, 1/10W; Manufacture 1: Yageo; Manufacture Part Number 1: RC0603FR-07100KL; Component Group: Resistor; Case-EIA: 0603; Case-Metric: 1608; Rated Power: 0.1W; Rated Voltage: 75VDC; Part Number: RCHIP-100K-0603; Footprint: 0603; Pin Count: 2; Supplier 1: Digi-Key; Supplier Part Number 1: 311-100KHRCT-ND; Value: 100k; Tolerance: 1%; Mounting Technology: SMT; Temperature Range: -55C to 155C; Component Kind: Standard; Component Type: Standard
R76 R87 R94 R101 R108 R115 = RCHIP-150K-0603: 150k res, 0603, 1%, 1/10W; Manufacture 1: Yageo; Manufacture Part Number 1: RC0603FR-07150KL; Component Group: Resistor; Case-EIA: 0603; Case-Metric: 1608; Rated Power: 0.1W; Rated Voltage: 75VDC; Part Number: RCHIP-150K-0603; Footprint: 0603; Pin Count: 2; Supplier 1: Digi-Key; Supplier Part Number 1: 311-150KHRCT-ND; Value: 150k; Tolerance: 1%; Mounting Technology: SMT; Temperature Range: -55C to 155C; Component Kind: Standard; Component Type: Standard
R77 R83 R89 R97 R104 R111 = RCHIP-1k-0603: 1k res, 0603, 1%, 1/10W; Manufacture 1: Yageo; Manufacture Part Number 1: RC0603FR-071KL; Component Group: Resistor; Case-EIA: 0603; Case-Metric: 1608; Rated Power: 0.1W; Rated Voltage: 75VDC; Part Number: RCHIP-1K-0603; Footprint: 0603; Pin Count: 2; Supplier 1: Digi-Key; Supplier Part Number 1: 311-1.00KHRCT-ND; Value: 1k; Tolerance: 1%; Mounting Technology: SMT; Temperature Range: -55C to 155C; Component Kind: Standard; Component Type: Standard
R78 R85 R92 R99 R106 R113 = RCHIP-2K-0402: 2k res, 0402, 1%, 1/16W; Manufacture 1: Yageo; Manufacture Part Number 1: RC0402FR-072KL; Component Group: Resistor; Case-EIA: 0402; Case-Metric: 1005; Rated Power: 0.063W; Rated Voltage: 75VDC; Part Number: RCHIP-2K-0402; Footprint: 0402; Pin Count: 2; Supplier 1: Digi-Key; Supplier Part Number 1: 311-2KLRCT-ND; Value: 2k; Tolerance: 1%; Mounting Technology: SMT; Temperature Range: -55C to 155C; Component Kind: Standard; Component Type: Standard
R79 R86 R93 R100 R107 R114 = RCHIP-180R-0402: 180R res, 0402, 1%, 1/16W; Manufacture 1: Yageo; Manufacture Part Number 1: RC0402FR-07180RL; Component Group: Resistor; Case-EIA: 0402; Case-Metric: 1005; Rated Power: 0.063W; Rated Voltage: 75VDC; Part Number: RCHIP-180R-0402; Footprint: 0402; Pin Count: 2; Supplier 1: Digi-Key; Supplier Part Number 1: 311-180LRCT-ND; Value: 180R; Tolerance: 1%; Mounting Technology: SMT; Temperature Range: -55C to 155C; Component Kind: Standard; Component Type: Standard
R80 R88 R95 R102 R109 R116 = RCHIP-1K-0402: as R53 on sheet sb-sonata-usbrp; Part Number: RCHIP-1K-0402; Footprint: 0402; Pin Count: 2; Supplier 1: Digi-Key; Supplier Part Number 1: 311-1.00KLRCT-ND; Value: 1k; Tolerance: 1%; Mounting Technology: SMT; Temperature Range: -55C to 155C; Component Kind: Standard; Component Type: Standard
R81 R90 R96 R103 R110 R117 = RCHIP-845R-0402: 845R res, 0402, 1%, 1/16W; Manufacture 1: Yageo; Manufacture Part Number 1: RC0402FR-07845RL; Component Group: Resistor; Case-EIA: 0402; Case-Metric: 1005; Rated Power: 0.063W; Rated Voltage: 75VDC; Part Number: RCHIP-845R-0402; Footprint: 0402; Pin Count: 2; Supplier 1: Digi-Key; Supplier Part Number 1: YAG3244CT-ND; Value: 845R; Tolerance: 1%; Mounting Technology: SMT; Temperature Range: -55C to 155C; Component Kind: Standard; Component Type: Standard
R82 = RCHIP-10R-0603: 10R res, 0603, 1%, 1/10W; Manufacture 1: Yageo; Manufacture Part Number 1: RC0603FR-0710RL; Component Group: Resistor; Case-EIA: 0603; Case-Metric: 1608; Rated Power: 0.1W; Rated Voltage: 75VDC; Part Number: RCHIP-10R-0603; Footprint: 0603; Pin Count: 2; Supplier 1: Digi-Key; Supplier Part Number 1: 311-10.0HRCT-ND; Value: 10R; Tolerance: 1%; Mounting Technology: SMT; Temperature Range: -55C to 155C; Component Kind: Standard; Component Type: Standard
U20 U21 = CMP-0187-00805-2: None; Nominal Supply Current: 45uA; Power Supply Rejection Ratio (PSRR): 63dB; Unity Gain Bandwidth Product: 1MHz; Amplifier Type: GENERAL PURPOSE; Voltage Gain: 110dB; Number of Channels: 4; Output Current: 15mA; Max Supply Voltage: 6V; Min Supply Voltage: 1.8V; Slew Rate: 0.5V/µs; Input Bias Current: 100pA; Input Offset Voltage (Vos): 4.5mV; Common Mode Rejection Ratio: 56dB; Number of Pins: 14; Case/Package: TSSOP; Packaging: Tape and Reel; Technology: CMOS; Lead Free: Lead Free; Max Operating Temperature: 125°C; Mount: Surface Mount; Number of Circuits: 4; Number of Elements: 4; Supply Current: 45uA; RoHS Compliant: Yes; Gain Bandwidth Product: 1MHz; Min Operating Temperature: -40°C